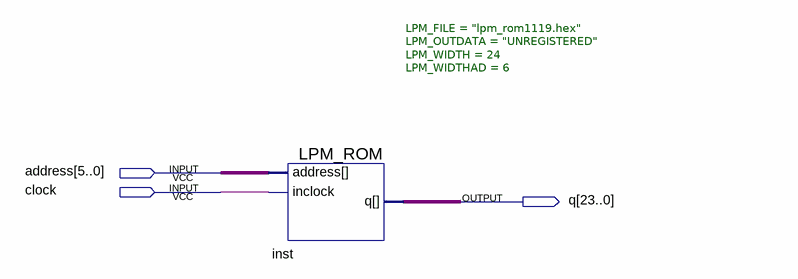
[diagram p0: schematic sheet]
// Quartus schematic lpm_rom1119.bdf as structural Verilog: 1 symbols, 3 pins
module lpm_rom1119 (
  input  [5:0] address,
  input  clock,
  output [23:0] q
);

  LPM_ROM #(.LPM_FILE("lpm_rom1119.hex"), .LPM_OUTDATA("UNREGISTERED"), .LPM_WIDTH(24), .LPM_WIDTHAD(6)) inst (
    .address(address), .inclock(clock), .q(q));
endmodule
